# Altium schematic sheet X-22 NOTE.SchDoc: FRDM-IMX93
size 513 x 386 mm; DrawnBy: FORLINX; Organization: ORGANIZATION; Address1: ADDRESS 1; Address2: ADDRESS 2; Address3: ADDRESS 3; Address4: ADDRESS 4; Revision: -; ENG_APP_DATE: --/--/--; DSN_APP_DATE: --/--/--; CHK_APP_DATE: --/--/--; Classification: Public, Company Internal/Proprietary, Company Confidential,  Company Secret; Page Create Date: March  8, 1995; OrgName: NXP Semiconductor; FIUO: A; OrgAddr1: NO. 192 Liangjing Rd. Pudong New Area, ShangHai; Page Number: 22; PageTitle: NOTE; Page Size: C; Comment: TitleBlock_MCPG; Page Count: 23; Designer: FORLINX; RevCode: B1; Approver: NXP SE; Doc: SCH-94611 PDF: SPF-94611; DsnPath: T:\FILES\Designs\Single Board Computers\i.MX93-FRDM\Design Files\SCH-94611_B1.DSN; SchematicName: FRDM-i.MX 93 Development Board; PageName: X-22 NOTE; PageSize: C; TopSchematic: True
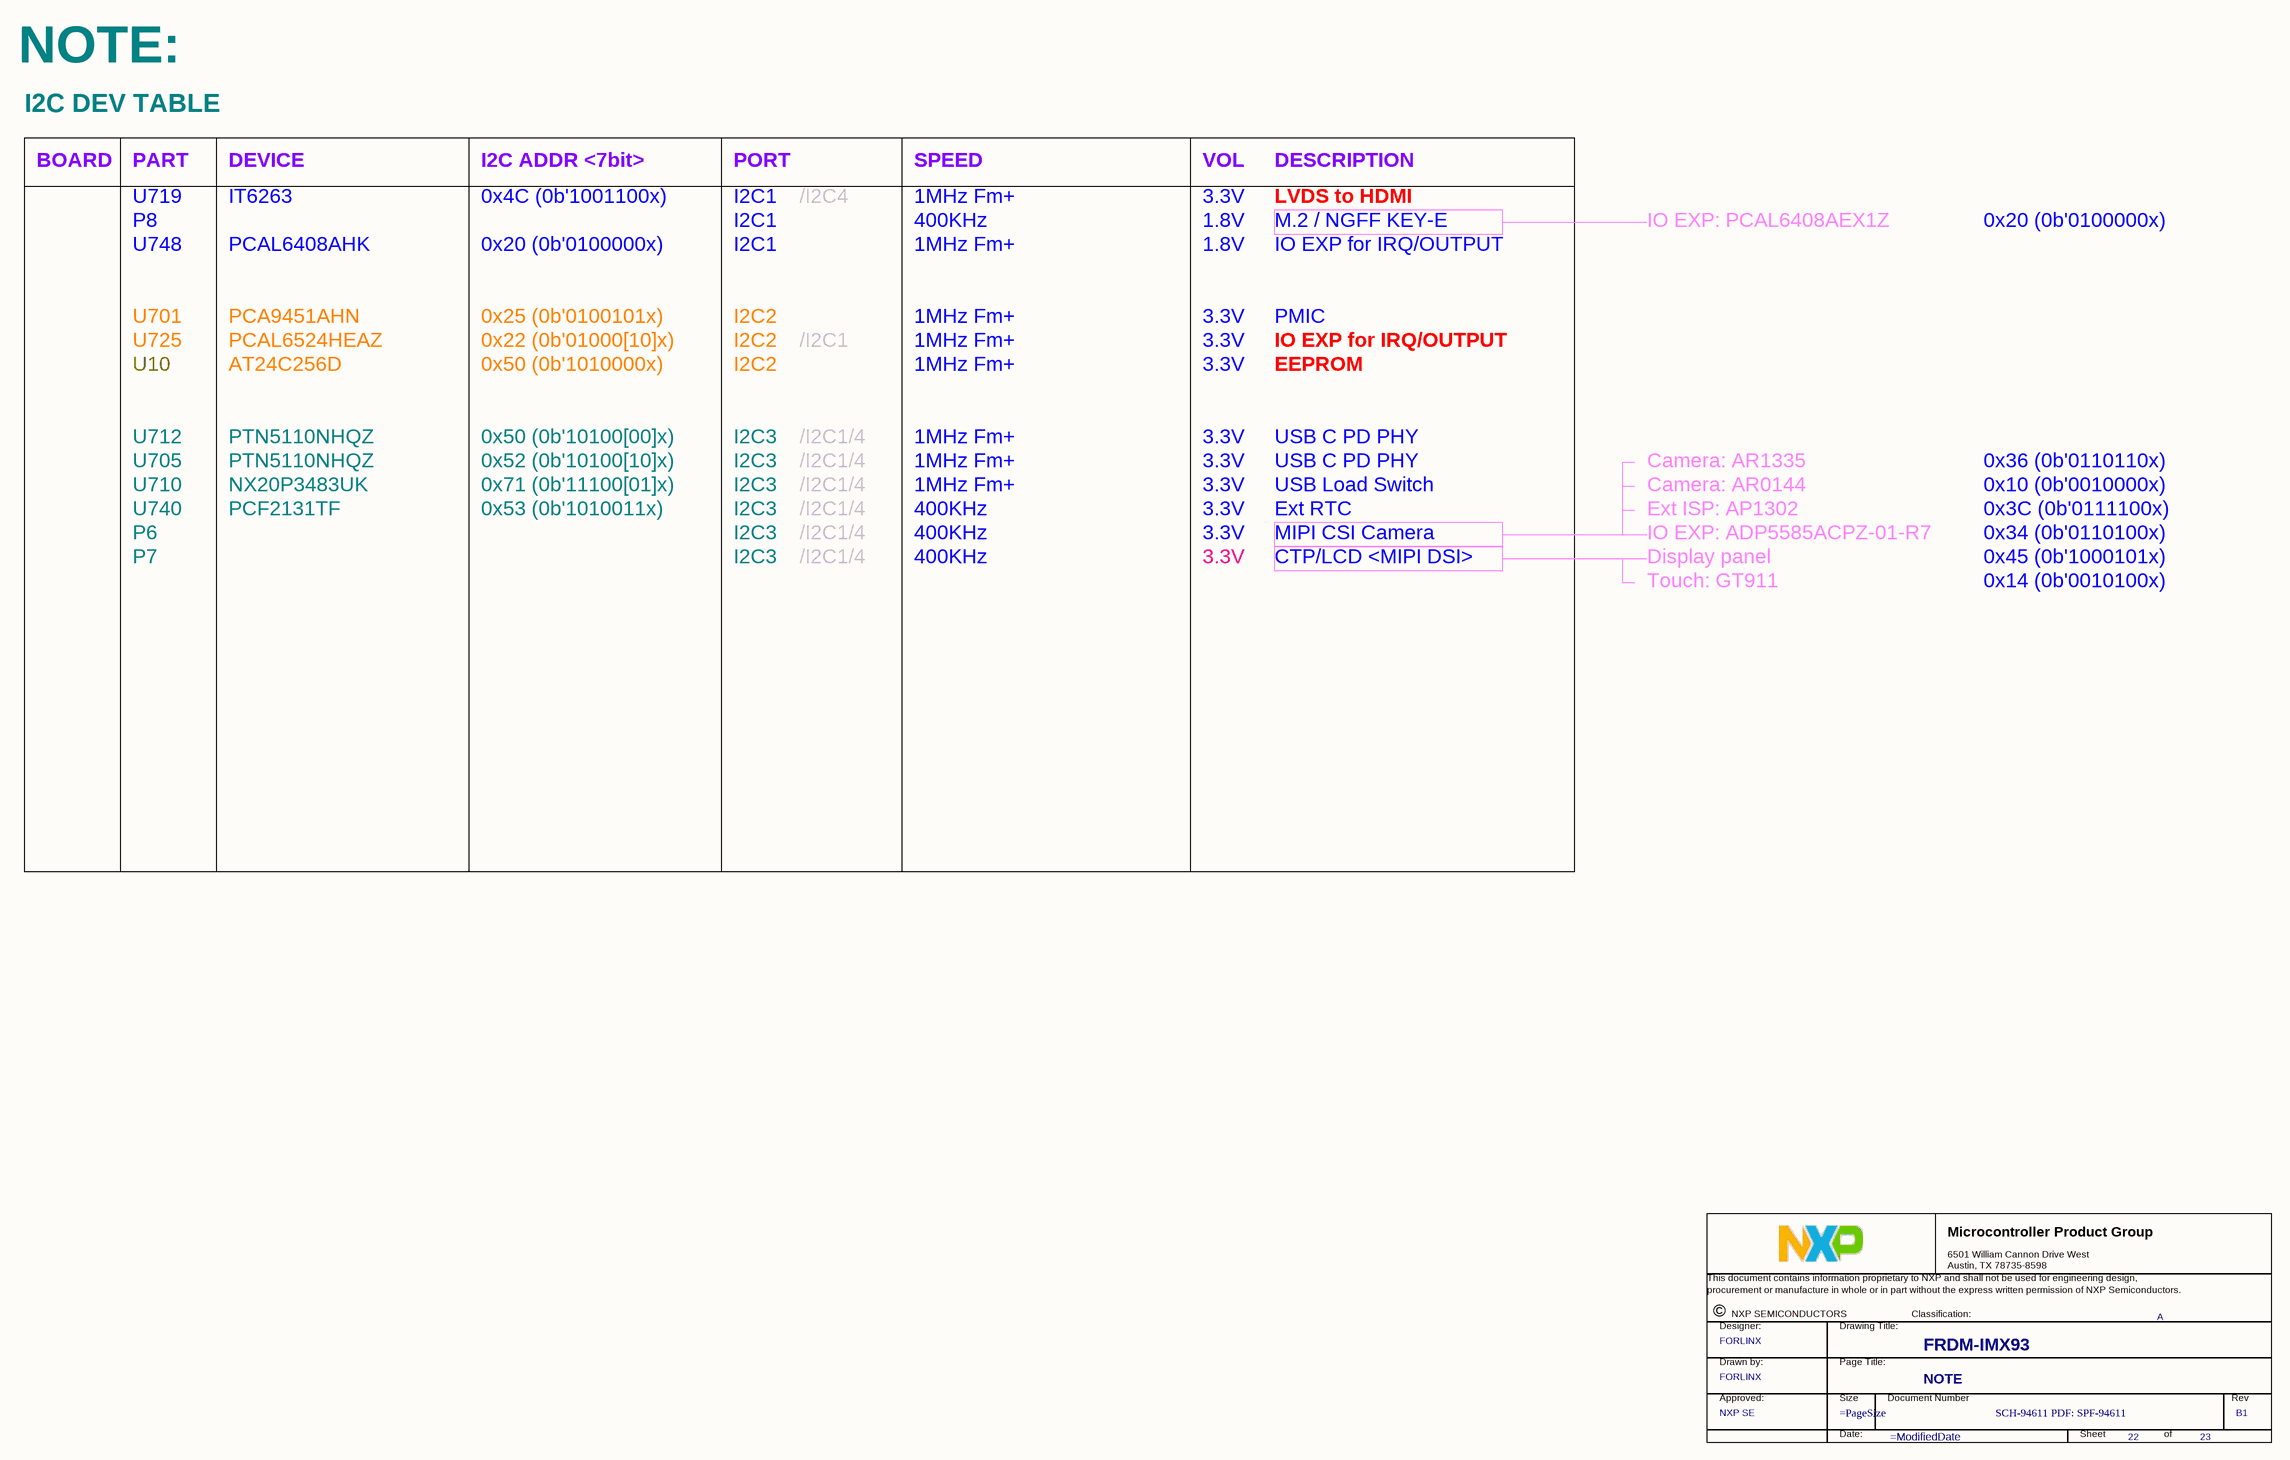
[diagram p0: X-22 NOTE.SchDoc]

## Parts
*  Title: FRDM-IMX93  RevCode: B1  PageTitle: NOTE  Page Number: 22  Page Count: 23  DrawnBy: FORLINX  Doc: SCH-94611 PDF: SPF-94611  Approver: NXP SE  FIUO: A  (hidden comment: TitleBlock_MCPG)  (graphical)

## Notes on the sheet
- NOTE:
- I2C DEV TABLE
- BOARD
- U719
- PART
- DEVICE
- IT6263
- 0x4C (0b'1001100x)
- I2C ADDR <7bit>
- PORT
- I2C1
- /I2C4
- SPEED
- 1MHz Fm+
- 3.3V
- VOL
- DESCRIPTION
- LVDS to HDMI
- U748
- P8
- PCAL6408AHK
- 0x20 (0b'0100000x)
- 400KHz
- 1.8V
- IO EXP for IRQ/OUTPUT
- M.2 / NGFF KEY-E
- IO EXP: PCAL6408AEX1Z
- U701
- PCA9451AHN
- 0x25 (0b'0100101x)
- I2C2
- PMIC
- U725
- U10
- PCAL6524HEAZ
- AT24C256D
- 0x22 (0b'01000[10]x)
- 0x50 (0b'1010000x)
- /I2C1
- EEPROM
- U712
- PTN5110NHQZ
- 0x50 (0b'10100[00]x)
- I2C3
- /I2C1/4
- USB C PD PHY
- U710
- U740
- U705
- PCF2131TF
- NX20P3483UK
- 0x53 (0b'1010011x)
- 0x52 (0b'10100[10]x)
- 0x71 (0b'11100[01]x)
- Ext RTC
- USB Load Switch
- Camera: AR0144
- Camera: AR1335
- Ext ISP: AP1302
- 0x3C (0b'0111100x)
- 0x10 (0b'0010000x)
- 0x36 (0b'0110110x)
- P6
- P7
- CTP/LCD <MIPI DSI>
- MIPI CSI Camera
- IO EXP: ADP5585ACPZ-01-R7
- Display panel
- 0x45 (0b'1000101x)
- 0x34 (0b'0110100x)
- Touch: GT911
- 0x14 (0b'0010100x)
- DWG. NO.
- REV.
- SHT.
- REVISION
- DATE
- APPROVED
- ENG:
- APPROVALS
- quilter.ai <http://quilter.ai>
- DSN:
- CHK:
- REFERENCE DOCUMENTS
- TITLE
- PROJECT
- BOM:
- FAB DWG:
- PCB DWG:
- ASSY DWG:
- SIZE
- FILE NAME
- C
- DWG NO.
- SHEET
- OF
- REV
- (in symbol TitleBlock_MCPG) Microcontroller Product Group; 6501 William Cannon Drive West / Austin, TX 78735-8598; This document contains information proprietary to NXP and shall not be used for engineering design,; procurement or manufacture in whole or in part without the express written permission of NXP Semiconductors.; ©; NXP SEMICONDUCTORS; Classification:; Designer:; Drawing Title:; Drawn by:; Page Title:; Approved:; Size; Document Number; Rev; Date:; Sheet; of

## Library data of the parts
* = TitleBlock_MCPG: Classification: Public, Company Internal/Proprietary, Company Confidential,  Company Secret; OrgName: NXP Semiconductor; OrgAddr1: NO. 192 Liangjing Rd. Pudong New Area, ShangHai; Page Size: =PageSize; Page Create Date: March  8, 1995; Designer: FORLINX; Page Modify Date: =ModifiedDate